# Altium schematic sheet Relay_Isolate_12V.SchDoc: Isolate Relay Driver
size A4; CompanyName: github.com/aKaReZa75; Revision: 1.0; SheetNumber: 1; SheetTotal: 1; Project_Name: Design Template
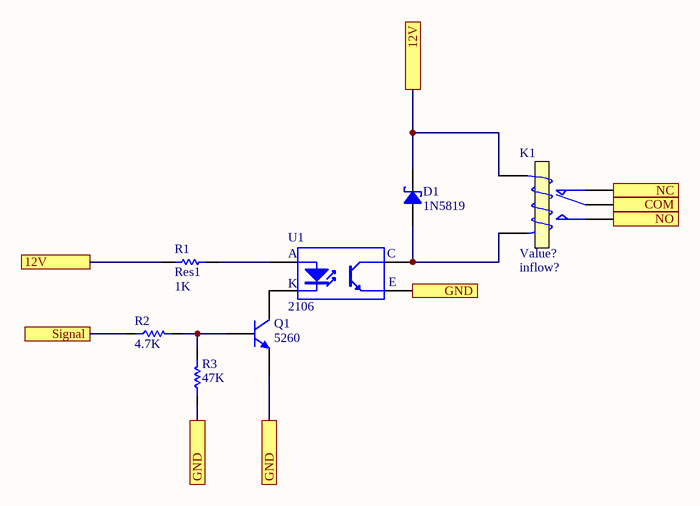
[diagram p0: Relay_Isolate_12V.SchDoc]

## Parts
D1  1N5819  [430X270D]
K1  Inflow: inflow?  [Relay 18.85x15.35x15.70]  (hidden comment: Value?)
Q1  Inflow: 5260  [SOT23_N]  (hidden comment: NPN)
R1  Res1  value 1K  [c0805]
R2  4.7K  [RES 0805 (2012X06L)]
R3  47K  [RES 0805 (2012X06L)]
U1  Inflow: 2106  [DIP-4]  (hidden comment: PC817)

## Ports
12V, COM, GND, NC, NO, Signal

## Nets
12V: D1.2 K1.4(T1) R1.2 ; port 12V
COM: K1.1(COM) ; port COM
GND: Q1.2(E) R3.1 U1.3(E) ; port GND
NC: K1.2(NC) ; port NC
NO: K1.3(NO) ; port NO
Signal: R2.1 ; port Signal
NetD1_1: D1.1 K1.5(T2) U1.4(C)
NetQ1_1: Q1.1(B) R2.2 R3.2
NetQ1_3: Q1.3(C) U1.2(K)
NetR1_1: R1.1 U1.1(A)

## Notes on the sheet
- Title:
- Project:
- Drawn by:
- Revision:
- Hossein Bagheri
- Company:
- Sheet
- of

## Library data of the parts
D1 = Semi_Diod_Sch_1N5819_SMD: Schottky Rectifiers; Rating: Rating?; Validation: Valid; Inflow: inflow?; Package: SMA; Type: Schottky; Value: 1N5819
K1 = SW_Relay_SPDT: SPDT Relay; Rating: Rating?; Validation: Valid; Type: SPDT; Package: Dip; Value: Value?
Q1 = Semi_BJT_2N2222_SMD: NPN Switching Transistors; Rating: Rating?; Type: Type?; Value: NPN; Package: Package?
R1 = Res1: Resistor; Published: 8-Jun-2000; LatestRevisionDate: 17-Jul-2002; LatestRevisionNote: Re-released for DXP Platform.; PackageReference: AXIAL-0.3; Publisher: Altium Limited; PackageDescription: Axial Device, Thru-Hole; 2 Leads; 0.3 in Pin Spacing
R2 R3 = Res_SMD_0805: Resistor; Inflow: inflow?; Rating: 0.125W; Validation: Valid; Package: 0805; Type: 10%
  R2: Value: 4.7K
  R3: Value: 47K
U1 = SW_Opto_PC817: DIP 4pin General Purpose Photocoupler; Rating: Rating?; Validation: Valid; Value: PC817; Package: Package?; Type: Type?